# EAGLE design robot_arm (EAGLE 9.6.2)
AUTHOR: AGENA, CEJA, TENNEY; BOARD_NAME: ARM PCB; DOC_NUM: 1; PROJECT_NAME: ROBOT ARM; REVISION: 0
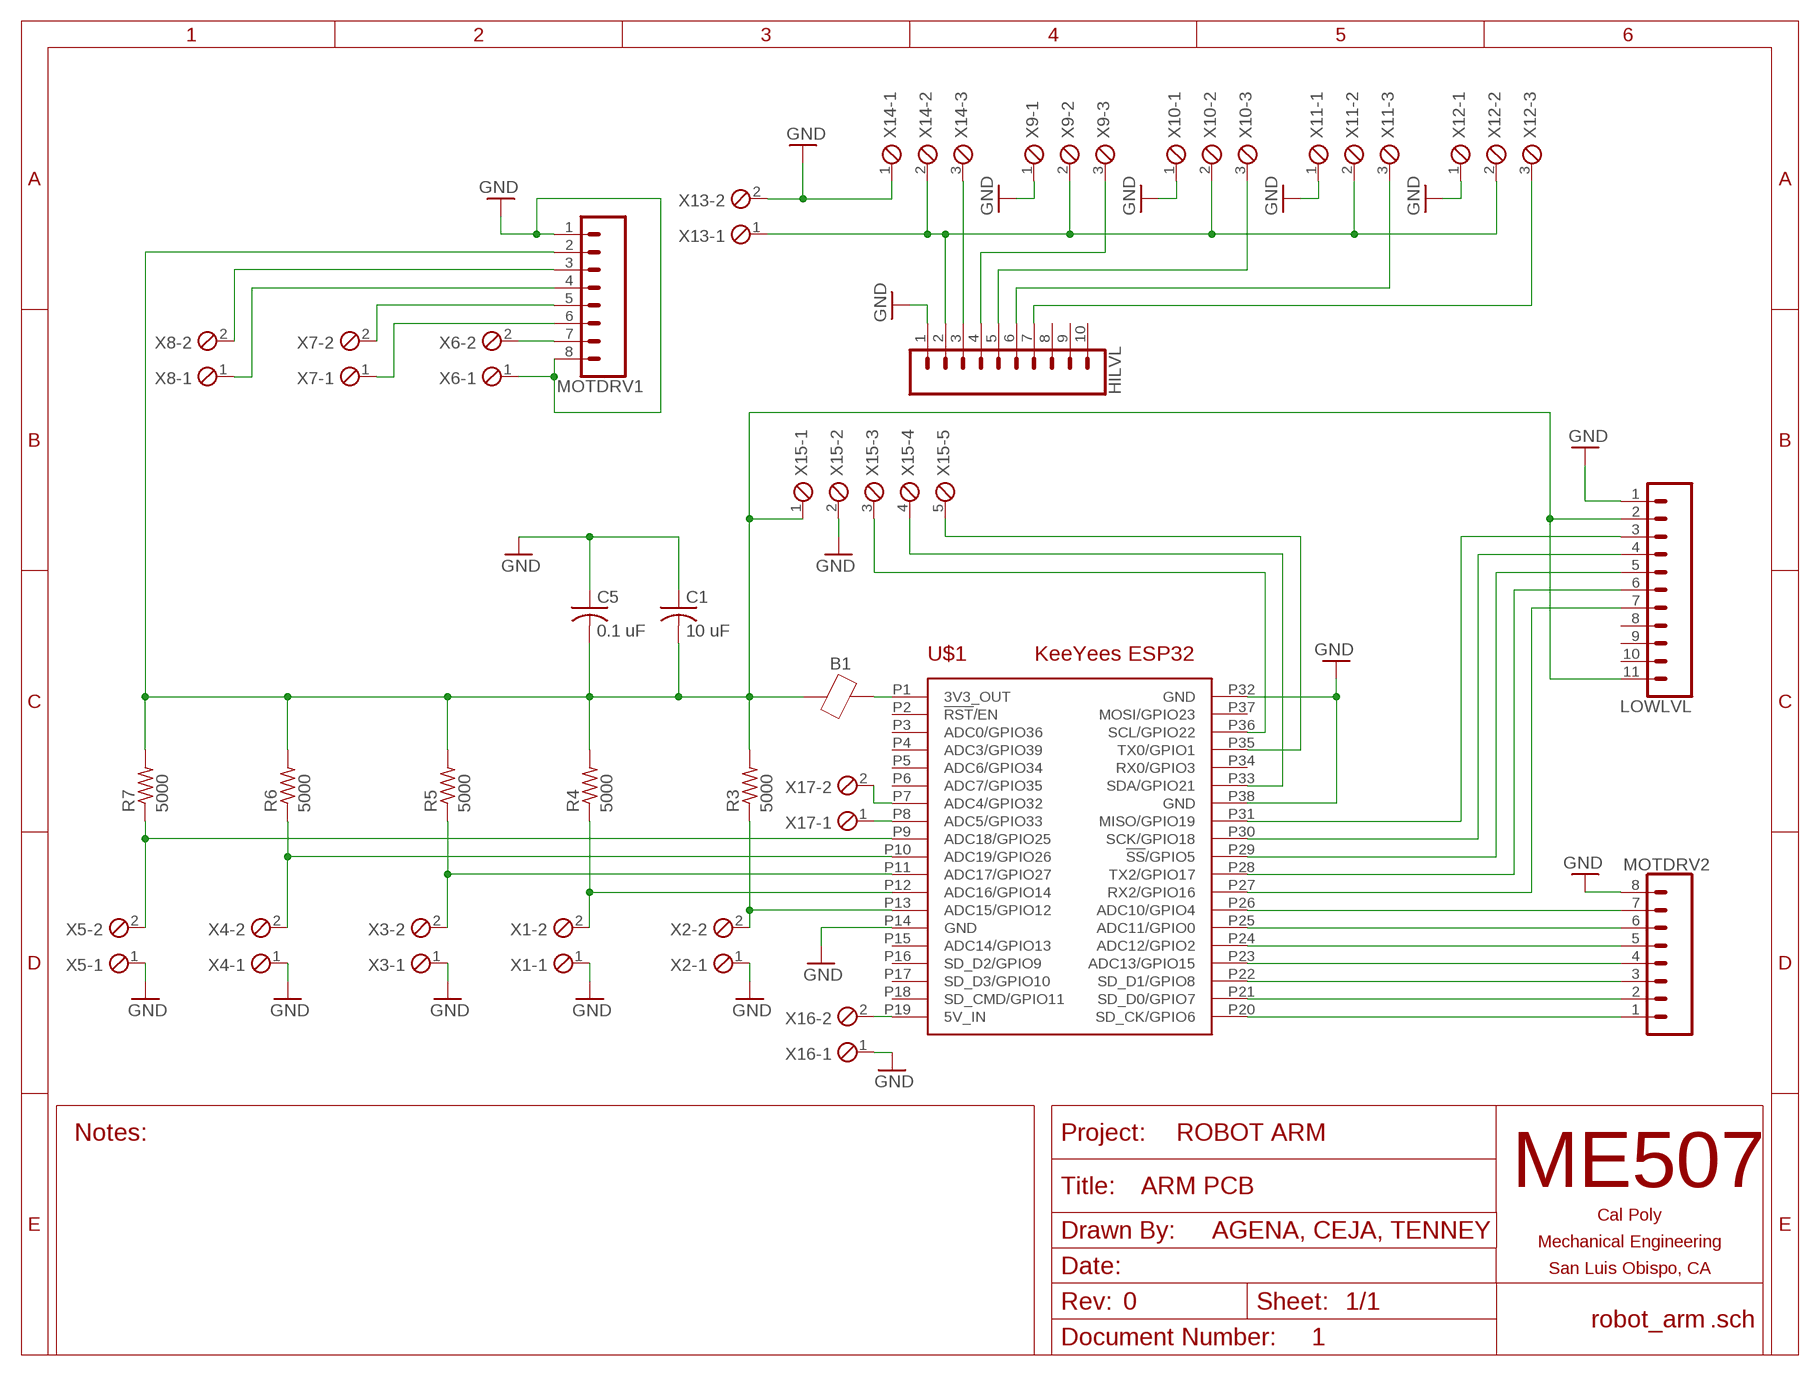
[diagram p0: schematic, sheet 1]

## Parts
B1  BEAD0805  [0805]
C1  10 uF  C-USC0805  [C0805]
C5  0.1 uF  C-USC0805  [C0805]
HILVL  CONN_10"  [1X10]
LOWLVL  CONN_11  [1X11]
MOTDRV1  CONN_08"  [1X08]
MOTDRV2  CONN_08"  [1X08]
R3  5000  R-US_R0805  [R0805]
R4  5000  R-US_R0805  [R0805]
R5  5000  R-US_R0805  [R0805]
R6  5000  R-US_R0805  [R0805]
R7  5000  R-US_R0805  [R0805]
U$1  KEEYEES_ESP32EXT  [KEEYEES_ESP32_EXTENDED]
X1  SCREWTERM_2P_254  [2POL254]
X2  SCREWTERM_2P_254  [2POL254]
X3  SCREWTERM_2P_254  [2POL254]
X4  SCREWTERM_2P_254  [2POL254]
X5  SCREWTERM_2P_254  [2POL254]
X6  SCREWTERM_2P_254  [2POL254]
X7  SCREWTERM_2P_254  [2POL254]
X8  SCREWTERM_2P_254  [2POL254]
X9  SCREWTERM_3P_254  [3POL254]
X10  SCREWTERM_3P_254  [3POL254]
X11  SCREWTERM_3P_254  [3POL254]
X12  SCREWTERM_3P_254  [3POL254]
X13  SCREWTERM_2P_254  [2POL254]
X14  SCREWTERM_3P_254  [3POL254]
X15  SCREWTERM_5P_254  [5POL254]
X16  SCREWTERM_2P_254  [2POL254]
X17  SCREWTERM_2P_254  [2POL254]

## Nets
AIN1: MOTDRV2.3 U$1.P22(SD_D1/GPIO8)
AIN2: MOTDRV2.2 U$1.P21(SD_D0/GPIO7)
AO1: MOTDRV1.3 X8.2
AO2: MOTDRV1.4 X8.1
BIN1: MOTDRV2.5 U$1.P24(ADC12/GPIO2)
BIN2: MOTDRV2.6 U$1.P25(ADC11/GPIO0)
BO1: MOTDRV1.6 X7.1
BO2: MOTDRV1.5 X7.2
GND: C1.1 C5.1 HILVL.1 LOWLVL.1 MOTDRV1.1 MOTDRV1.8 MOTDRV2.8 U$1.P14(GND) U$1.P32(GND) U$1.P38(GND) X1.1 X2.1 X3.1 X4.1 X5.1 X6.1 X9.1 X10.1 X11.1 X12.1 X13.2 X14.1 X15.2 X16.1
N$1: R3.1 U$1.P13(ADC15/GPIO12) X2.2
N$2: R4.1 U$1.P12(ADC16/GPIO14) X1.2
N$4: B1.2 U$1.P1(3V3_OUT)
N$5: U$1.P36(SCL/GPIO22) X15.3
N$6: U$1.P33(SDA/GPIO21) X15.4
N$7: R5.1 U$1.P11(ADC17/GPIO27) X3.2
N$9: R6.1 U$1.P10(ADC19/GPIO26) X4.2
N$10: U$1.P35(TX0/GPIO1) X15.5
N$11: R7.1 U$1.P9(ADC18/GPIO25) X5.2
N$12: U$1.P19(5V_IN) X16.2
N$13: U$1.P8(ADC5/GPIO33) X17.1
N$14: U$1.P7(ADC4/GPIO32) X17.2
N$15: HILVL.3 X14.3
N$16: HILVL.4 X9.3
N$17: HILVL.5 X10.3
N$18: HILVL.6 X11.3
N$19: HILVL.7 X12.3
N$20: LOWLVL.3 U$1.P31(MISO/GPIO19)
N$21: LOWLVL.4 U$1.P30(SCK/GPIO18)
N$22: LOWLVL.5 U$1.P29(!SS!/GPIO5)
N$23: LOWLVL.6 U$1.P28(TX2/GPIO17)
N$24: LOWLVL.7 U$1.P27(RX2/GPIO16)
N$25: HILVL.2 X9.2 X10.2 X11.2 X12.2 X13.1 X14.2
PWMA: MOTDRV2.1 U$1.P20(SD_CK/GPIO6)
PWMB: MOTDRV2.7 U$1.P26(ADC10/GPIO4)
STBY: MOTDRV2.4 U$1.P23(ADC13/GPIO15)
VCC: B1.1 C1.2 C5.2 LOWLVL.2 LOWLVL.11 MOTDRV1.2 R3.2 R4.2 R5.2 R6.2 R7.2 X15.1
VMOT: MOTDRV1.7 X6.2
Unconnected: HILVL.8 HILVL.9 HILVL.10 LOWLVL.8 LOWLVL.9 LOWLVL.10 U$1.P2(!RST!/EN) U$1.P3(ADC0/GPIO36) U$1.P4(ADC3/GPIO39) U$1.P5(ADC6/GPIO34) U$1.P6(ADC7/GPIO35) U$1.P15(ADC14/GPIO13) U$1.P16(SD_D2/GPIO9) U$1.P17(SD_D3/GPIO10) U$1.P18(SD_CMD/GPIO11) U$1.P34(RX0/GPIO3) U$1.P37(MOSI/GPIO23)

## Library data of the parts
B1 = ME507:BEAD: Ferrite Bead
C1 C5 = rcl:C-US: CAPACITOR, American symbol; SPICEPREFIX: C
HILVL = SparkFun-Connectors:CONN_10: Multi connection point. Often used as Generic Header-pin footprint for 0.1 inch spaced/style header connections On any of the 0.1 inch spaced packages, you can populate with these: Break Away Headers - Straight <https://www.sparkfun.com/products/116> (PRT-00116) Break Away Male Headers - Right Angle <https://www.sparkfun.com/products/553> (PRT-00553) Female Headers <https://www.sparkfun.com/products/115> (PRT-00115) Break Away Headers - Machine Pin <https://www.sparkfun.com/products/117> (PRT-00117) Break Away Female Headers - Swiss Machine Pin <https://www.sparkfun.com/products/743> (PRT-00743) Arduino Stackable Header - 10 Pin <https://www.sparkfun.com/products/11376> (PRT-11376) For SCREWTERMINALS and SPRING TERMINALS visit here: Screw Terimnals on SparkFun.com <https://www.sparkfun.com/search/results?term=Screw+Terminals> (5mm/3.5mm/2.54mm spacing) This device is also useful as a general connection point to wire up your design to another part of your project. Our various solder wires solder well into these plated through hole pads. Hook-Up Wire - Assortment (Stranded, 22 AWG) <https://www.sparkfun.com/products/11375> (PRT-11375) Hook-Up Wire - Assortment (Solid Core, 22 AWG) <https://www.sparkfun.com/products/11367> (PRT-11367) View the entire wire category on our website here <https://www.sparkfun.com/categories/141> Special notes: Molex polarized connector foot print use with SKU : PRT-08231 with associated crimp pins and housings. 1MM SMD Version SKU: PRT-10208 NOTES ON THE VARIANTS LOCK and LOCK_LONGPADS... This footprint was designed to help hold the alignment of a through-hole component (i.e. 6-pin header) while soldering it into place. You may notice that each hole has been shifted either up or down by 0.005 of an inch from it's more standard position (which is a perfectly straight line). This slight alteration caused the pins (the squares in the middle) to touch the edges of the holes. Because they are alternating, it causes a "brace" to hold the component in place. 0.005 has proven to be the perfect amount of "off-center" position when using our standard breakaway headers. Although looks a little odd when you look at the bare footprint, once you have a header in there, the alteration is very hard to notice. Also,if you push a header all the way into place, it is covered up entirely on the bottom side.; PROD_ID: CONN-11563
LOWLVL = SparkFun-Connectors:CONN_11: Multi connection point. Often used as Generic Header-pin footprint for 0.1 inch spaced/style header connections On any of the 0.1 inch spaced packages, you can populate with these: Break Away Headers - Straight <https://www.sparkfun.com/products/116> (PRT-00116) Break Away Male Headers - Right Angle <https://www.sparkfun.com/products/553> (PRT-00553) Female Headers <https://www.sparkfun.com/products/115> (PRT-00115) Break Away Headers - Machine Pin <https://www.sparkfun.com/products/117> (PRT-00117) Break Away Female Headers - Swiss Machine Pin <https://www.sparkfun.com/products/743> (PRT-00743) For SCREWTERMINALS and SPRING TERMINALS visit here: Screw Terimnals on SparkFun.com <https://www.sparkfun.com/search/results?term=Screw+Terminals> (5mm/3.5mm/2.54mm spacing) This device is also useful as a general connection point to wire up your design to another part of your project. Our various solder wires solder well into these plated through hole pads. Hook-Up Wire - Assortment (Stranded, 22 AWG) <https://www.sparkfun.com/products/11375> (PRT-11375) Hook-Up Wire - Assortment (Solid Core, 22 AWG) <https://www.sparkfun.com/products/11367> (PRT-11367) View the entire wire category on our website here <https://www.sparkfun.com/categories/141>
MOTDRV1 MOTDRV2 = SparkFun-Connectors:CONN_08: Multi connection point. Often used as Generic Header-pin footprint for 0.1 inch spaced/style header connections On any of the 0.1 inch spaced packages, you can populate with these: Break Away Headers - Straight <https://www.sparkfun.com/products/116> (PRT-00116) Break Away Male Headers - Right Angle <https://www.sparkfun.com/products/553> (PRT-00553) Female Headers <https://www.sparkfun.com/products/115> (PRT-00115) Break Away Headers - Machine Pin <https://www.sparkfun.com/products/117> (PRT-00117) Break Away Female Headers - Swiss Machine Pin <https://www.sparkfun.com/products/743> (PRT-00743) Arduino Stackable Header - 8 Pin <https://www.sparkfun.com/products/9279> (PRT-09279) For SCREWTERMINALS and SPRING TERMINALS visit here: Screw Terimnals on SparkFun.com <https://www.sparkfun.com/search/results?term=Screw+Terminals> (5mm/3.5mm/2.54mm spacing) This device is also useful as a general connection point to wire up your design to another part of your project. Our various solder wires solder well into these plated through hole pads. Hook-Up Wire - Assortment (Stranded, 22 AWG) <https://www.sparkfun.com/products/11375> (PRT-11375) Hook-Up Wire - Assortment (Solid Core, 22 AWG) <https://www.sparkfun.com/products/11367> (PRT-11367) View the entire wire category on our website here <https://www.sparkfun.com/categories/141> Special notes: Molex polarized connector foot print use with SKU : PRT-08231 with associated crimp pins and housings. 1MM SMD Version SKU: PRT-10208 NOTES ON THE VARIANTS LOCK and LOCK_LONGPADS... This footprint was designed to help hold the alignment of a through-hole component (i.e. 6-pin header) while soldering it into place. You may notice that each hole has been shifted either up or down by 0.005 of an inch from it's more standard position (which is a perfectly straight line). This slight alteration caused the pins (the squares in the middle) to touch the edges of the holes. Because they are alternating, it causes a "brace" to hold the component in place. 0.005 has proven to be the perfect amount of "off-center" position when using our standard breakaway headers. Although looks a little odd when you look at the bare footprint, once you have a header in there, the alteration is very hard to notice. Also,if you push a header all the way into place, it is covered up entirely on the bottom side.; PROD_ID: CONN-08438
R3-R7 = rcl:R-US_: RESISTOR, American symbol; SPICEPREFIX: R
U$1 = ME507:KEEYEES_ESP32: Footprint for an add-on board (shield, hat, etc.) for a KeeYees ESP32 development board with ESP-WROOM-32 module. 38 pins.
X1-X8 X13 X16 X17 = ME507:SCREWTERM_2P: Screw Terminal Block This part is designed for a screw terminal connector. The 2.54mm (0.100 inch) foorprint can also be used for male or female pin headers such as those on most development boards. One can also solder wires directly into the holes, though this makes modifications or repairs to the system more inconvenient. Larger versions can carry more current.
X9-X12 X14 = ME507:SCREWTERM_3P: Screw Terminal Block This part is designed for a screw terminal connector. The 2.54mm (0.100 inch) foorprint can also be used for male or female pin headers such as those on most development boards. One can also solder wires directly into the holes, though this makes modifications or repairs to the system more inconvenient. Larger versions can carry more current.
X15 = ME507:SCREWTERM_5P: Screw Terminal Block This part is designed for a screw terminal connector. The 2.54mm (0.100 inch) foorprint can also be used for male or female pin headers such as those on most development boards. One can also solder wires directly into the holes, though this makes modifications or repairs to the system more inconvenient. Larger versions can carry more current.

## Board
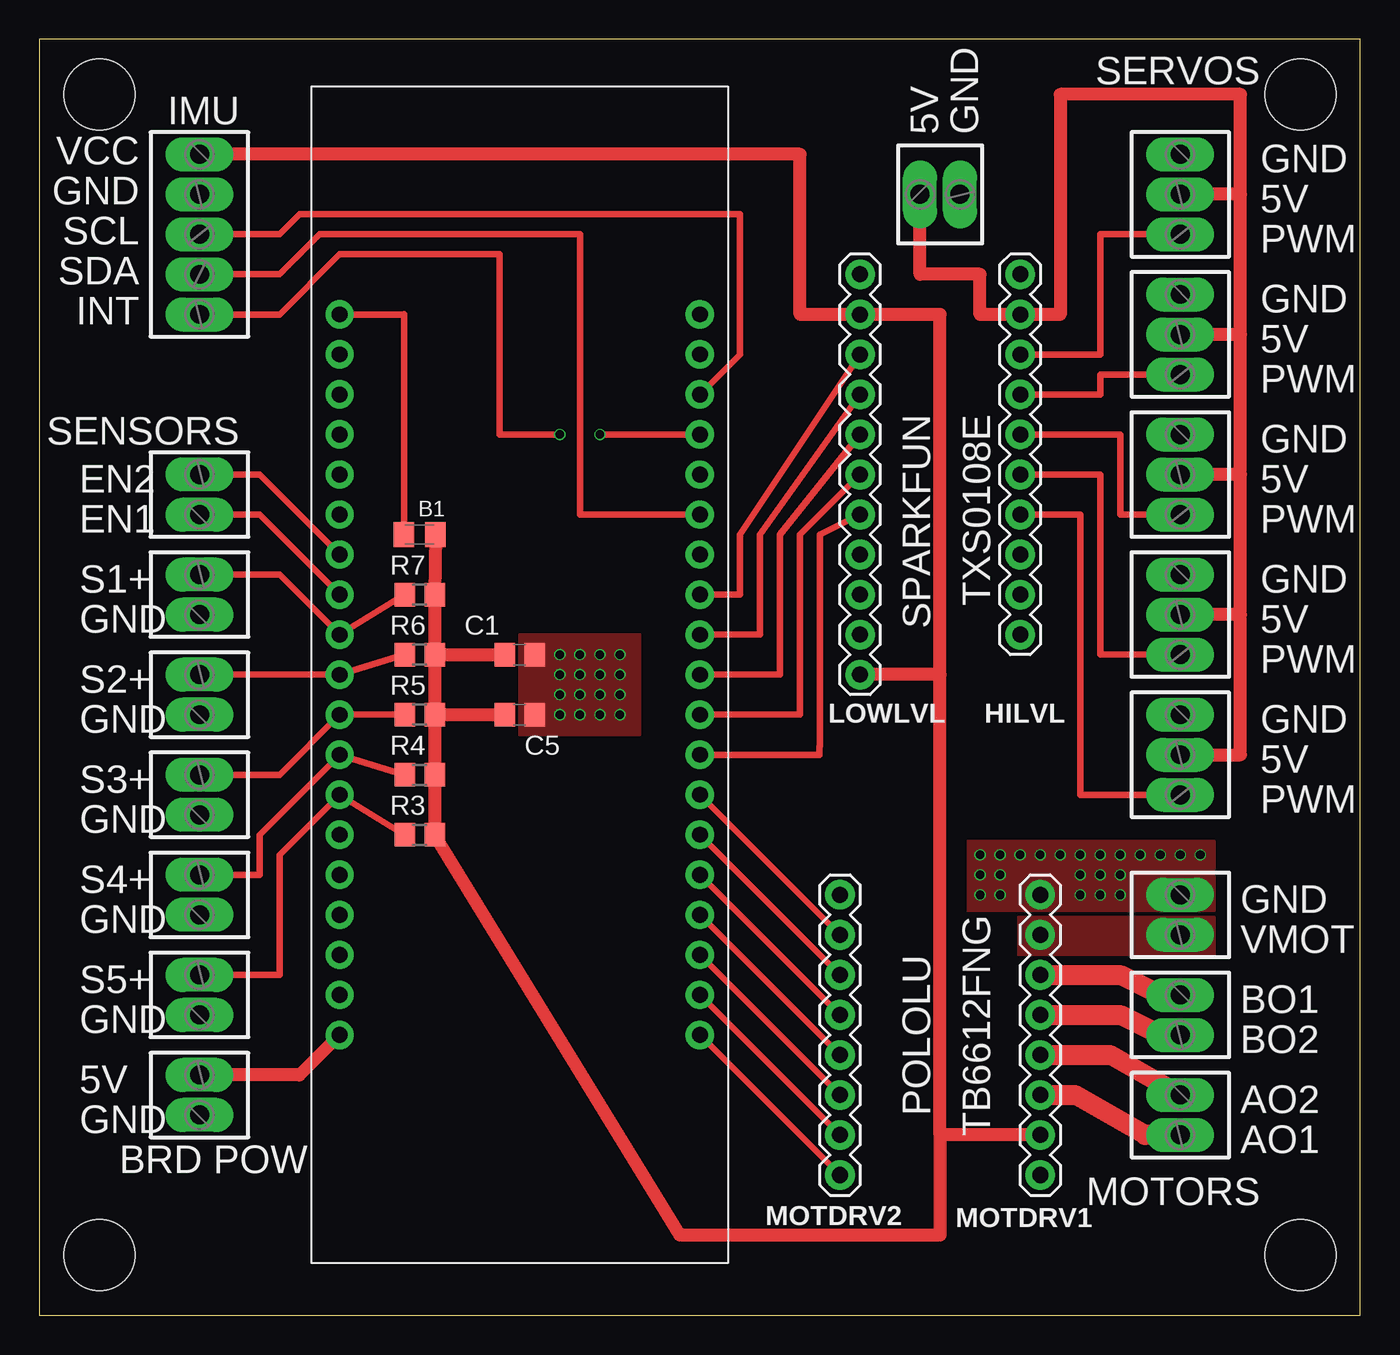
[diagram p1: board, top side]
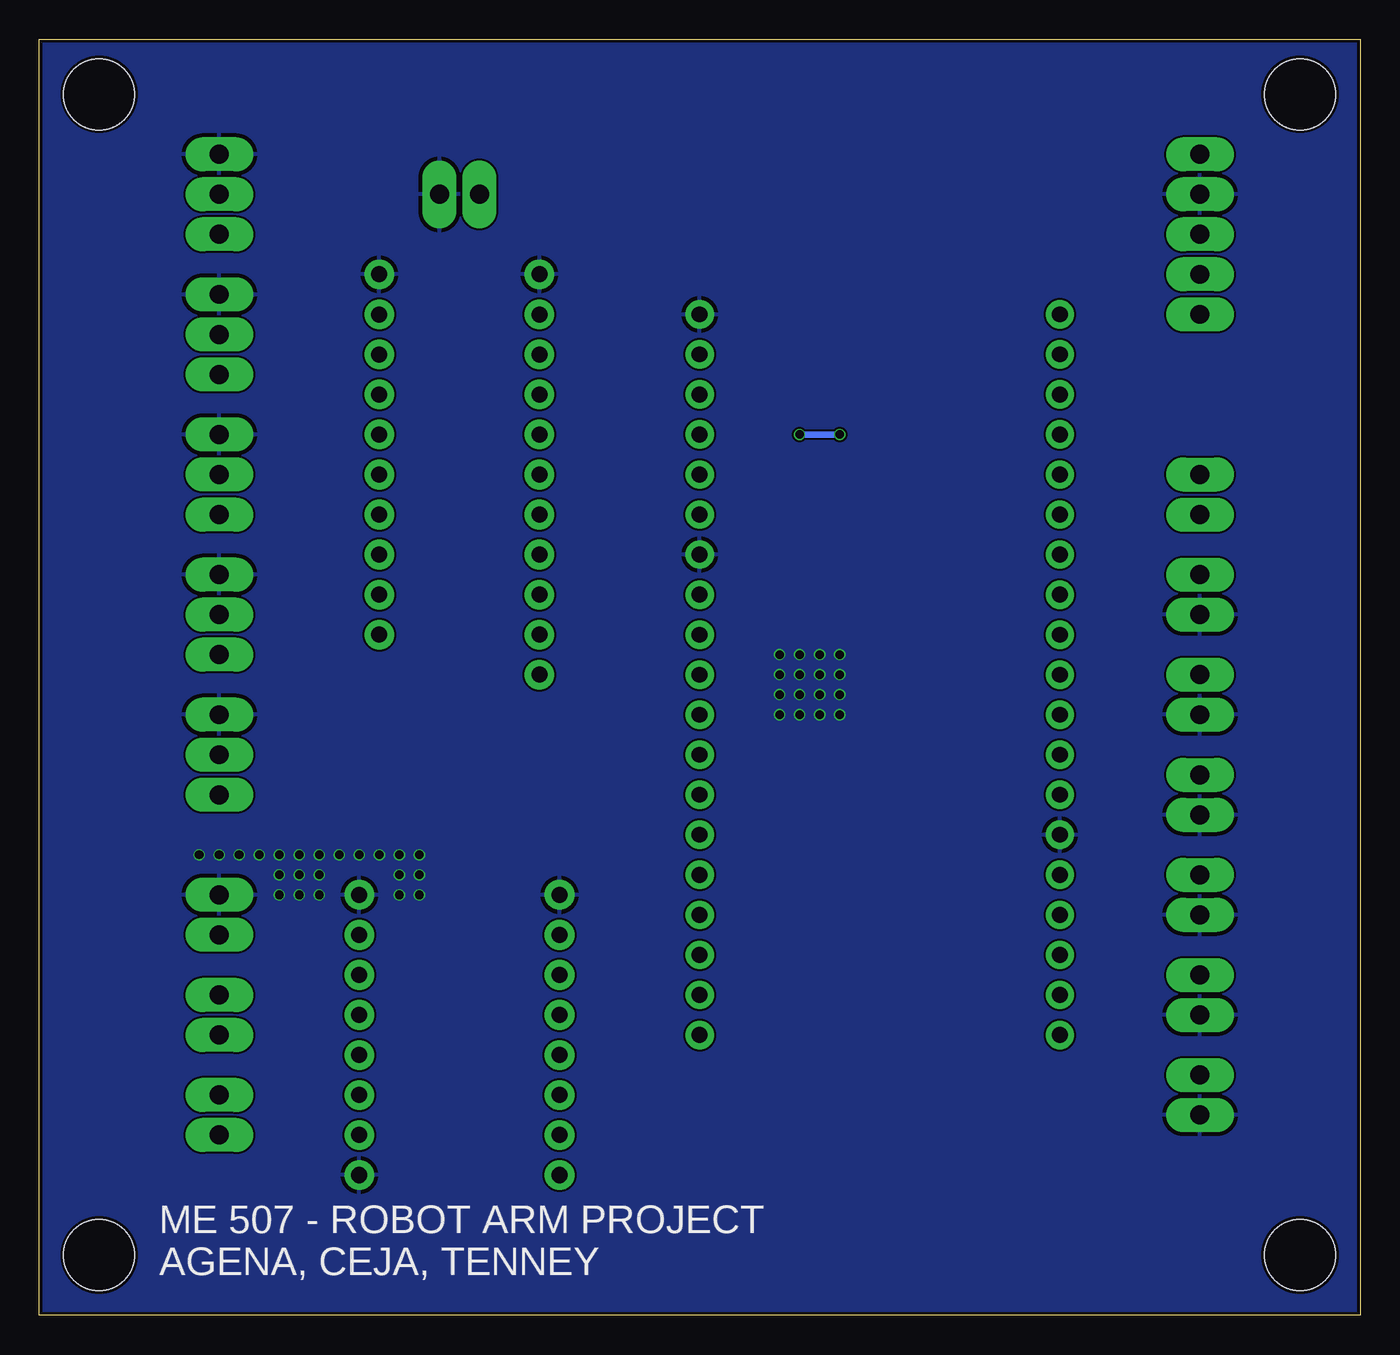
[diagram p2: board, bottom side, seen from below]

Size 83.8 x 80.95 mm. Coordinates in mm from the lower left corner, seen from the top.
Outline: 0,0 83.8,0 83.8,80.95 0,80.95 0,0
Copper layers (1*16): Top 0.035mm / dielectric 1.6mm / Bottom 0.035mm
Design rules "jlcpcb-2layers": minimum track width 5mil, minimum drill 0.3mm, track to track 5mil, track to pad 5mil, pad to pad 5mil, via to via 5mil, smd to smd 5mil, copper to edge 0.2mm, drill to drill 6mil, minimum pad ring 10mil, minimum via ring 3mil, stop-mask expansion 4mil, vias tented up to drill 0mil, thermal gap 10mil
Holes 4.5 mm at 80.01,77.47 3.81,3.81 80.01,3.81 3.81,77.47

### Footprints (pad centres in the part's own frame; a part is rotated, then mirrored left to right if it is on the bottom)
0805 = smd 1.3 x 1.6: 1 -1,0; 2 1,0
C0805 = smd 1.3 x 1.5: 1 -0.95,0; 2 0.95,0
1X10 = drill 1.016 pad 1.88: 1 0,0; 2 2.54,0; 3 5.08,0; 4 7.62,0; 5 10.16,0; 6 12.7,0; 7 15.24,0; 8 17.78,0; 9 20.32,0; 10 22.86,0
1X11 = drill 1.016 pad 1.88: 1 0,0; 2 2.54,0; 3 5.08,0; 4 7.62,0; 5 10.16,0; 6 12.7,0; 7 15.24,0; 8 17.78,0; 9 20.32,0; 10 22.86,0; 11 25.4,0
1X08 = drill 1.016 pad 1.88: 1 0,0; 2 2.54,0; 3 5.08,0; 4 7.62,0; 5 10.16,0; 6 12.7,0; 7 15.24,0; 8 17.78,0
R0805 = smd 1.3 x 1.5: 1 -0.95,0; 2 0.95,0
KEEYEES_ESP32_EXTENDED = drill 1 pad 1.778: P1 -11.43,21.59; P2 -11.43,19.05; P3 -11.43,16.51; P4 -11.43,13.97; P5 -11.43,11.43; P6 -11.43,8.89; P7 -11.43,6.35; P8 -11.43,3.81; P9 -11.43,1.27; P10 -11.43,-1.27; P11 -11.43,-3.81; P12 -11.43,-6.35; P13 -11.43,-8.89; P14 -11.43,-11.43; P15 -11.43,-13.97; P16 -11.43,-16.51; P17 -11.43,-19.05; P18 -11.43,-21.59; P19 -11.43,-24.13; P20 11.43,-24.13; P21 11.43,-21.59; P22 11.43,-19.05; P23 11.43,-16.51; P24 11.43,-13.97; P25 11.43,-11.43; P26 11.43,-8.89; P27 11.43,-6.35; P28 11.43,-3.81; P29 11.43,-1.27; P30 11.43,1.27; P31 11.43,3.81; P32 11.43,6.35; P33 11.43,8.89; P34 11.43,11.43; P35 11.43,13.97; P36 11.43,16.51; P37 11.43,19.05; P38 11.43,21.59
2POL254 = drill 1.2 long: 1 -1.27,0; 2 1.27,0
3POL254 = drill 1.2 long: 1 -2.54,0; 2 0,0; 3 2.54,0
5POL254 = drill 1.2 long: 1 -5.08,0; 2 -2.54,0; 3 0,0; 4 2.54,0; 5 5.08,0

### Placement (x,y rotation side)
B1  24.13,49.53 180 top
C1  30.48,41.91 180 top
C5  30.48,38.1 180 top
HILVL  62.23,66.04 270 top
LOWLVL  52.07,66.04 270 top
MOTDRV1  63.5,8.89 90 top
MOTDRV2  50.8,8.89 90 top
R3  24.13,30.48 0 top
R4  24.13,34.29 0 top
R5  24.13,38.1 0 top
R6  24.13,41.91 0 top
R7  24.13,45.72 0 top
U$1  30.48,41.91 0 top
X1  10.16,26.67 90 top
X2  10.16,20.32 90 top
X3  10.16,33.02 90 top
X4  10.16,39.37 90 top
X5  10.16,45.72 90 top
X6  72.39,25.4 270 top
X7  72.39,19.05 270 top
X8  72.39,12.7 270 top
X9  72.39,62.23 270 top
X10  72.39,53.34 270 top
X11  72.39,44.45 270 top
X12  72.39,35.56 270 top
X13  57.15,71.12 0 top
X14  72.39,71.12 270 top
X15  10.16,68.58 270 top
X16  10.16,13.97 90 top
X17  10.16,52.07 90 top

### Tracks (layer width: path | path; a pad name or v marks a point on that pad's centre or on a via)
AIN1
  Top 0.406: U$1.P22 MOTDRV2.3
AIN2
  Top 0.406: U$1.P21 MOTDRV2.2
AO1
  Top 1.27: X8.2 70.17,11.43 65.72,13.97 MOTDRV1.3
AO2
  Top 1.27: X8.1 67.94,16.51 MOTDRV1.4
BIN1
  Top 0.406: U$1.P24 MOTDRV2.5
BIN2
  Top 0.406: U$1.P25 MOTDRV2.6
BO1
  Top 0.813: 71.12,20.32 X7.1
  Top 1.27: 71.12,20.32 68.58,21.59 MOTDRV1.6
BO2
  Top 0.813: 71.12,17.78 X7.2
  Top 1.27: 71.12,17.78 68.58,19.05 MOTDRV1.5
GND  (via drill 0.55)
  other vias: 59.69,29.21 60.96,29.21 62.23,29.21 63.5,29.21 64.77,29.21 66.04,29.21 67.31,29.21 68.58,29.21 69.85,29.21 71.12,29.21 72.39,29.21 73.66,29.21 60.96,27.94 60.96,26.67 59.69,27.94 59.69,26.67 66.04,27.94 66.04,26.67 67.31,27.94 67.31,26.67 68.58,27.94 68.58,26.67 33.02,41.91 34.29,41.91 35.56,41.91 36.83,41.91 36.83,40.64 36.83,39.37 36.83,38.1 35.56,38.1 34.29,38.1 33.02,38.1 33.02,39.37 33.02,40.64 34.29,40.64 34.29,39.37 35.56,39.37 35.56,40.64
  pour Bottom: 0,80.9 0,0 83.82,0 83.82,80.9
  pour Top (no thermals): 58.93,25.65 74.55,25.65 74.55,30.1 58.93,30.1
  pour Top (no thermals): 30.48,43.18 30.48,36.83 38.1,36.83 38.1,43.18
N$1
  Top 0.406: X2.2 15.24,21.59 15.24,29.21 U$1.P13 R3.1
N$2
  Top 0.406: X1.2 13.97,27.94 13.97,30.48 U$1.P12 R4.1
N$4
  Top 0.406: U$1.P1 22.86,63.5 23.13,63.51 B1.2
N$5
  Top 0.406: X15.3 15.24,68.58 16.51,69.85 44.45,69.85 44.45,60.96 U$1.P36
N$6
  Top 0.406: U$1.P33 34.29,50.8 34.29,68.58 17.78,68.58 15.24,66.04 X15.4
N$7
  Top 0.406: X3.2 15.24,34.29 U$1.P11 R5.1
N$9
  Top 0.406: X4.2 U$1.P10 R6.1
N$10  (via drill 0.55)
  Top 0.406: v35.56,55.88 U$1.P35 | v33.02,55.88 29.21,55.88 29.21,67.31 19.05,67.31 15.24,63.5 X15.5
  Bottom 0.406: v33.02,55.88 v35.56,55.88
N$11
  Top 0.406: X5.2 15.24,46.99 U$1.P9 R7.1
N$12
  Top 0.813: U$1.P19 16.51,15.24 X16.2
N$13
  Top 0.406: X17.1 13.97,50.8 U$1.P8
N$14
  Top 0.406: X17.2 13.97,53.34 U$1.P7
N$15
  Top 0.406: X14.3 67.31,68.58 67.31,60.96 HILVL.3
N$16
  Top 0.406: HILVL.4 67.31,58.42 67.31,59.69 X9.3
N$17
  Top 0.406: HILVL.5 68.58,55.88 68.58,50.8 X10.3
N$18
  Top 0.406: HILVL.6 67.31,53.34 67.31,41.91 X11.3
N$19
  Top 0.406: HILVL.7 66.04,50.8 66.04,33.02 X12.3
N$20
  Top 0.406: U$1.P31 44.45,45.72 44.45,49.53 LOWLVL.3
N$21
  Top 0.406: U$1.P30 45.72,43.18 45.72,49.53 LOWLVL.4
N$22
  Top 0.406: U$1.P29 46.99,40.64 46.99,49.53 LOWLVL.5
N$23
  Top 0.406: U$1.P28 48.26,38.1 48.26,49.53 LOWLVL.6
N$24
  Top 0.406: U$1.P27 49.51,35.56 49.51,36.1 49.53,36.12 49.53,49.53 LOWLVL.7
N$25
  Top 0.813: X12.2 76.2,35.56 76.2,44.45 | 76.2,44.45 X11.2 | 76.2,44.45 76.2,53.34 | 76.2,53.34 X10.2 | 76.2,53.34 76.2,62.23 | 76.2,62.23 X9.2 | 76.2,62.23 76.2,71.12 | 76.2,71.12 X14.2 | 76.2,71.12 76.2,77.47 64.77,77.47 64.77,63.5 HILVL.2 59.69,63.5 59.69,66.04 55.88,66.04 X13.1
PWMA
  Top 0.406: U$1.P20 MOTDRV2.1
PWMB
  Top 0.406: MOTDRV2.7 U$1.P26
STBY
  Top 0.406: U$1.P23 MOTDRV2.4
VCC
  Top 0.813: B1.1 R7.2 R6.2 | R6.2 R5.2 | R5.2 R4.2 R3.2 40.64,5.08 57.15,5.08 57.15,11.43 | R6.2 C1.2 | R5.2 C5.2 | MOTDRV1.2 57.15,11.43 | 57.15,11.43 57.15,40.64 | 57.15,40.64 LOWLVL.11 | 57.15,40.64 57.15,63.5 LOWLVL.2 48.26,63.5 48.26,73.66 X15.1
VMOT
  pour Top (no thermals): 62.1,25.27 74.55,25.27 74.55,22.86 62.1,22.86

### Text on the board
tNames: SERVOS | IMU | VCC | 5V | GND | GND | GND | SCL | 5V | SDA | PWM | INT | GND | 5V | PWM | SENSORS | SPARKFUN | TXS0108E | GND | EN2 | 5V | EN1 | PWM | S1+ | GND | GND | 5V | PWM | S2+ | GND | GND | 5V | S3+ | PWM | GND | S4+ | GND | TB6612FNG | GND | POLOLU | VMOT | S5+ | BO1 | GND | BO2 | 5V | AO2 | GND | AO1 | BRD POW | MOTORS
bNames: ME 507 - ROBOT ARM PROJECT / AGENA, CEJA, TENNEY
Measures: Units: inches | Units: inches